# Altium project rttl2rs485.PrjPcb
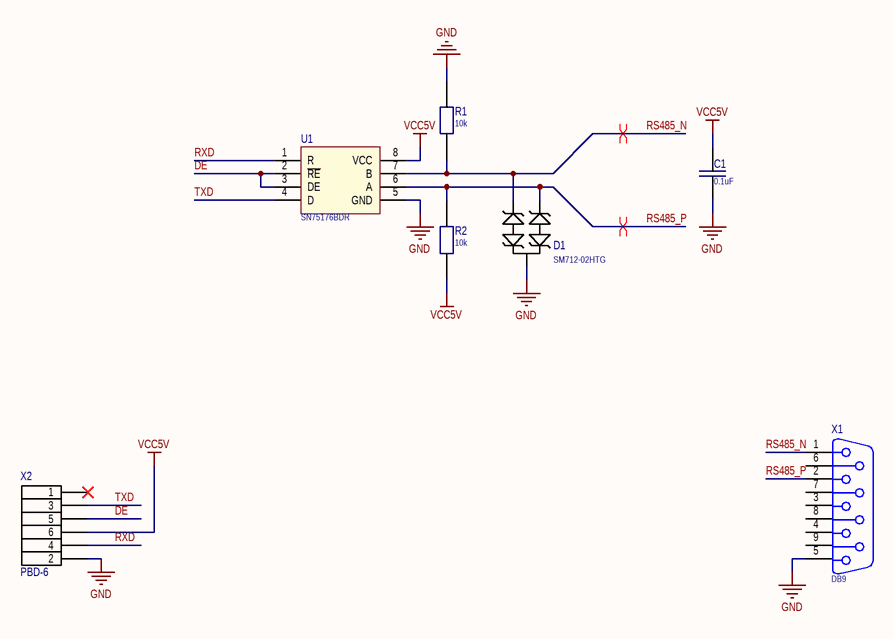
[diagram p0: ttl2rs485.SchDoc]
1 sheet, 7 parts. Net scope: global (net labels, ports and power ports of the same name join across sheets).
Board file: PCB.PcbDoc

## Sheet ttl2rs485.SchDoc
size 209 x 297 mm; SheetNumber: 1; SheetTotal: 1

### Parts
C1  0.1uF  [C_0603]
D1  SM712-02HTG  [SOT23]
R1  10k  [R_0603]
R2  10k  [R_0603]
U1  SN75176BDR  [SO-8]
X1  DB9  [DB9_template]  (no BOM)
X2  PBD-6  [PBD-6-sideways]

### Nets
GND: C1.1 D1.3 R1.2 U1.5(GND) X1.5 X2.2
VCC5V: C1.2 R2.1 U1.8(VCC) X2.6
DE: U1.2(~{RE}) U1.3(DE) X2.5
RS485_N: D1.1 R1.1 U1.7(B) X1.1
RS485_P: D1.2 R2.2 U1.6(A) X1.2
RXD: U1.1(R) X2.4
TXD: U1.4(D) X2.3

Not connected (* = marked no-connect by the designer): X1 3 4 6 7 8 9; X2 1*

### Layout directives
differential pair: RS485_N, RS485_P

### Library data of the parts
C1 = CAP_SMD: Capacitor; Part Number: CC0603KPX7R9BB104; Alternative Part: *; Value: 0.1uF
D1 = ESD: Value: SM712-02HTG; Part Number: SM712-02HTG; Alternative Part: *
R1 R2 = RES_SMD: Resistor; Part Number: RC0603FR-0710KL; Alternative Part: *; Value: 10k
U1 = SN75176BDR: RS485 Half Duplex Convertor; Part Number: SN75176BDR
X1 = DB9_template: Connector
X2 = PBD-6: Header, 6-Pin, Dual row; Part Number: PBD-6